# EAGLE schematic MBO (EAGLE 7.4.0)
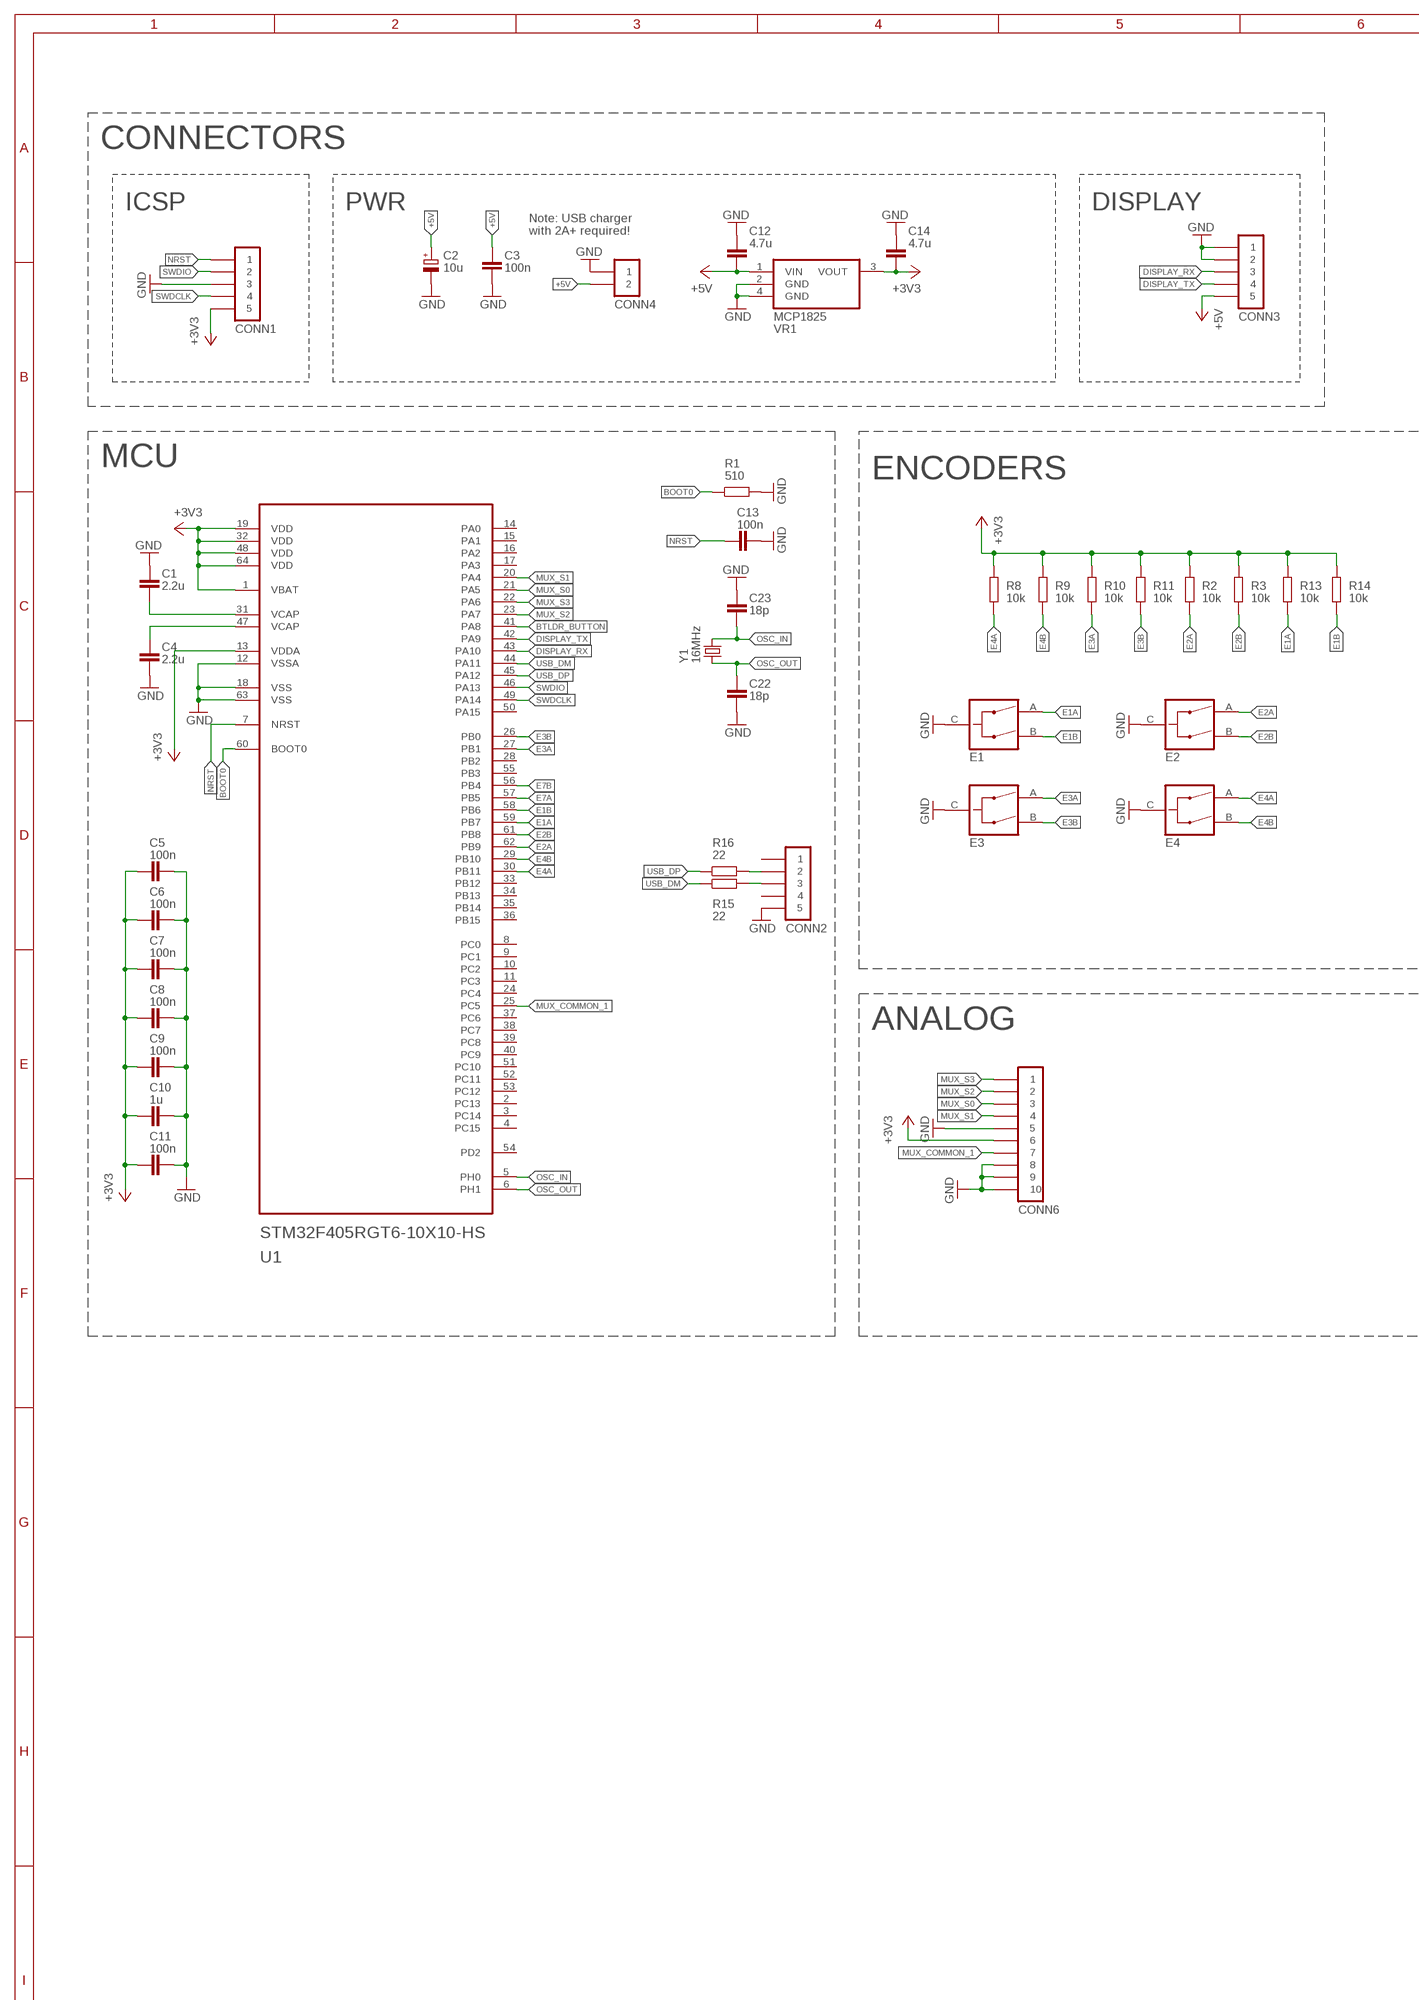
[diagram p0: schematic, sheet 1, part 1 of 2]
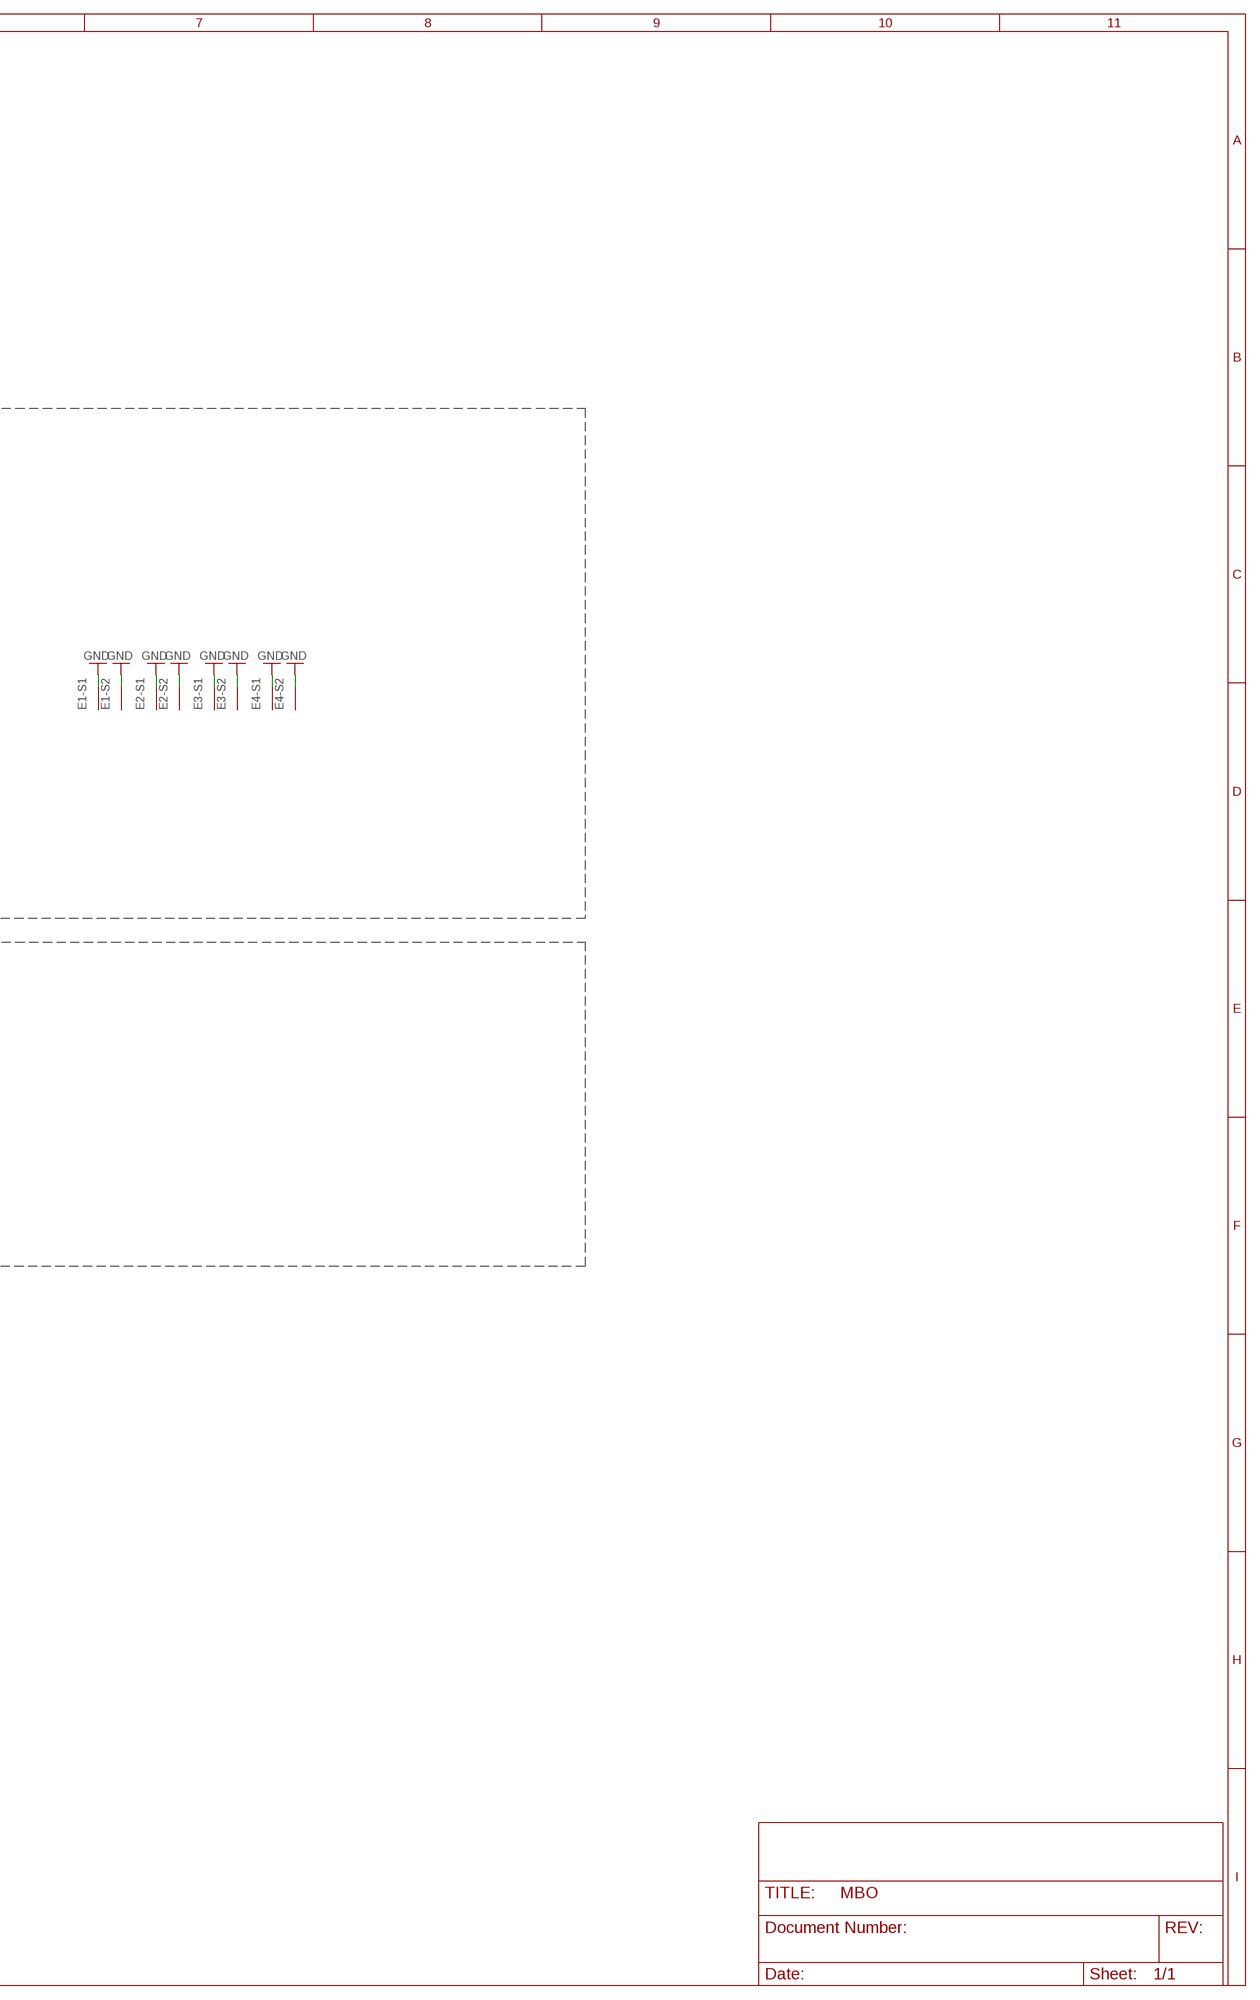
[diagram p1: schematic, sheet 1, part 2 of 2]

## Parts
C1  2.2u  CAPACITOR-0805  [C0805]
C2  10u  ELECTROLYTIC_CAPACITOR-C-TH-E-0401  [C-TH-E-0401]
C3  100n  CAPACITOR-0805  [C0805]
C4  2.2u  CAPACITOR-0805  [C0805]
C5  100n  CAPACITOR-0805  [C0805]
C6  100n  CAPACITOR-0805  [C0805]
C7  100n  CAPACITOR-0805  [C0805]
C8  100n  CAPACITOR-0805  [C0805]
C9  100n  CAPACITOR-0805  [C0805]
C10  1u  CAPACITOR-0805  [C0805]
C11  100n  CAPACITOR-0805  [C0805]
C12  4.7u  CAPACITOR-0805  [C0805]
C13  100n  CAPACITOR-0805  [C0805]
C14  4.7u  CAPACITOR-0805  [C0805]
C22  18p  CAPACITOR-0805  [C0805]
C23  18p  CAPACITOR-0805  [C0805]
CONN1  PINHD-1X05-TH-2.54MM  [1X05-2.54]
CONN2  PINHD-1X05-JST-XH-H  [JST-XH-05P-H]
CONN3  PINHD-1X05-JST-XH-H  [JST-XH-05P-H]
CONN4  PINHD-1X02-JST-XH-H  [JST-XH-02P-H]
CONN6  PINHD-1X10-FFC-1MM-Z  [MOLEX-52271-1079]
E1  ALPS-EC12E24404AX  [EC12E-1]
E2  ALPS-EC12E24404AX  [EC12E-1]
E3  ALPS-EC12E24404AX  [EC12E-1]
E4  ALPS-EC12E24404AX  [EC12E-1]
R1  510  RESISTOR-0805  [R0805]
R2  10k  RESISTOR-0805  [R0805]
R3  10k  RESISTOR-0805  [R0805]
R8  10k  RESISTOR-0805  [R0805]
R9  10k  RESISTOR-0805  [R0805]
R10  10k  RESISTOR-0805  [R0805]
R11  10k  RESISTOR-0805  [R0805]
R13  10k  RESISTOR-0805  [R0805]
R14  10k  RESISTOR-0805  [R0805]
R15  22  RESISTOR-0805  [R0805]
R16  22  RESISTOR-0805  [R0805]
U1  STM32F405RGT6-10X10-HS  [TQFP-64-10X10-HS]
VR1  MCP1825  [SOT223]
Y1  16MHz  CRYSTAL-HC49  [HC49US]

## Nets
+3V3: C5.1 C6.1 C7.1 C8.1 C9.1 C10.1 C11.1 C14.1 CONN1.5 CONN6.6 R2.2 R3.2 R8.2 R9.2 R10.2 R11.2 R13.2 R14.2 U1.1(VBAT) U1.13(VDDA) U1.19(VDD) U1.32(VDD) U1.48(VDD) U1.64(VDD) VR1.3(VOUT)
+5V: C2.+ C3.1 C12.1 CONN3.5 CONN4.2 VR1.1(VIN)
BOOT0: R1.1 U1.60(BOOT0)
BTLDR_BUTTON: U1.41(PA8)
DISPLAY_RX: CONN3.3 U1.43(PA10)
DISPLAY_TX: CONN3.4 U1.42(PA9)
E1A: E1.A R13.1 U1.59(PB7)
E1B: E1.B R14.1 U1.58(PB6)
E2A: E2.A R2.1 U1.62(PB9)
E2B: E2.B R3.1 U1.61(PB8)
E3A: E3.A R10.1 U1.27(PB1)
E3B: E3.B R11.1 U1.26(PB0)
E4A: E4.A R8.1 U1.30(PB11)
E4B: E4.B R9.1 U1.29(PB10)
E7A: U1.57(PB5)
E7B: U1.56(PB4)
GND: C1.1 C2.- C3.2 C4.2 C5.2 C6.2 C7.2 C8.2 C9.2 C10.2 C11.2 C12.2 C13.2 C14.2 C22.2 C23.1 CONN1.3 CONN2.5 CONN3.1 CONN3.2 CONN4.1 CONN6.5 CONN6.8 CONN6.9 CONN6.10 E1.C E1.S1(S) E1.S2(S) E2.C E2.S1(S) E2.S2(S) E3.C E3.S1(S) E3.S2(S) E4.C E4.S1(S) E4.S2(S) R1.2 U1.12(VSSA) U1.18(VSS) U1.63(VSS) VR1.2(GND) VR1.4(GND)
MUX_COMMON_1: CONN6.7 U1.25(PC5)
MUX_S0: CONN6.3 U1.21(PA5)
MUX_S1: CONN6.4 U1.20(PA4)
MUX_S2: CONN6.2 U1.23(PA7)
MUX_S3: CONN6.1 U1.22(PA6)
N$2: C1.2 U1.31(VCAP)
N$3: C4.1 U1.47(VCAP)
NRST: C13.1 CONN1.1 U1.7(NRST)
OSC_IN: C23.2 U1.5(PH0) Y1.2
OSC_OUT: C22.1 U1.6(PH1) Y1.1
SWDCLK: CONN1.4 U1.49(PA14)
SWDIO: CONN1.2 U1.46(PA13)
USB_DM: R15.1 U1.44(PA11)
USB_DM_ESD: CONN2.3 R15.2
USB_DP: R16.1 U1.45(PA12)
USB_DP_ESD: CONN2.2 R16.2
Unconnected: CONN2.1 CONN2.4 U1.2(PC13) U1.3(PC14) U1.4(PC15) U1.8(PC0) U1.9(PC1) U1.10(PC2) U1.11(PC3) U1.14(PA0) U1.15(PA1) U1.16(PA2) U1.17(PA3) U1.24(PC4) U1.28(PB2) U1.33(PB12) U1.34(PB13) U1.35(PB14) U1.36(PB15) U1.37(PC6) U1.38(PC7) U1.39(PC8) U1.40(PC9) U1.50(PA15) U1.51(PC10) U1.52(PC11) U1.53(PC12) U1.54(PD2) U1.55(PB3)

## Notes on the sheet
- CONNECTORS
- ICSP | PWR | DISPLAY
- Note: USB charger
  with 2A+ required!
- MCU
- ENCODERS
- ANALOG

## Library data of the parts
C1 C3-C14 C22 C23 = igor_lbr:CAPACITOR: Capacitor
C2 = igor_lbr:ELECTROLYTIC_CAPACITOR: Electrolytic capacitor
CONN1-CONN3 = igor_lbr:PINHD-1X05: Pin Header
CONN4 = igor_lbr:PINHD-1X02: Pin Header
CONN6 = igor_lbr:PINHD-1X10: Pin header; MANUFACTURER: Molex; MPN: 52271-1079
E1-E4 = igor_lbr:ALPS-EC12E24404AX: ALPS encoder
R1-R3 R8-R11 R13-R16 = igor_lbr:RESISTOR: Resistor
U1 = igor_lbr:STM32F405RGT6: ARM Cortex-M4 32b MCU+FPU
VR1 = igor_lbr:MCP1825: 500 mA, Low Voltage, Low Quiescent Current LDO Regulator; MANUFACTURER: Microchip; MPN: MCP1825S-3302E/DB
Y1 = igor_lbr:CRYSTAL: Crystal; MANUFACTURER: TXC; MPN: 9B-16.000MEEJ-B

## Net classes
0 default: width 0.203 mm
1 vcc: width 0.254 mm